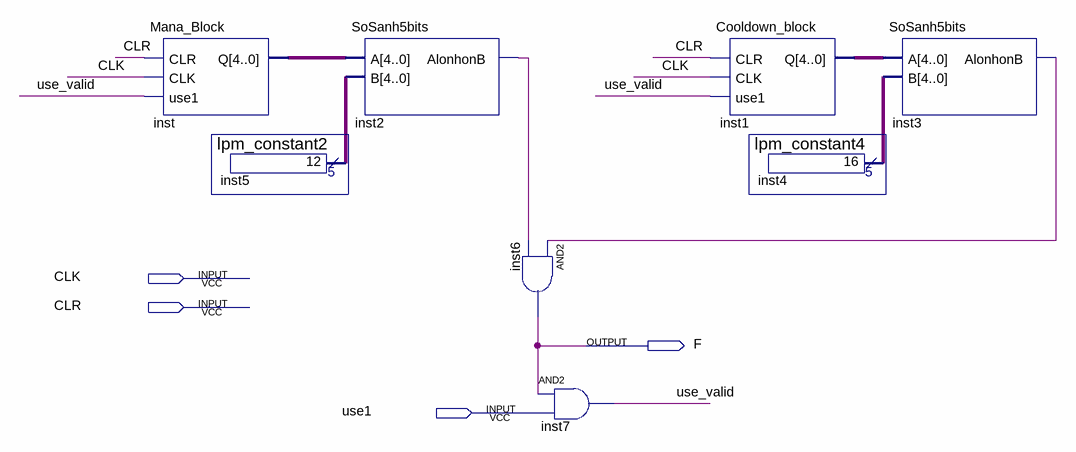
[diagram p0: schematic sheet]
// Quartus schematic ManaPlasmaField.bdf as structural Verilog: 8 symbols, 4 pins
module ManaPlasmaField (
  input  CLK,
  input  CLR,
  input  use1,
  output F
);

  wire inst2_alonhonb, inst3_alonhonb, use_valid;
  wire [4:0] inst1_q, inst4_result, inst5_result, inst_q;

  Mana_Block inst (.CLR(CLR), .CLK(CLK), .use1(use_valid), .Q(inst_q));
  lpm_constant2 inst5 (.result(inst5_result));
  SoSanh5bits inst2 (.A(inst_q), .B(inst5_result), .AlonhonB(inst2_alonhonb));
  and inst6 (F, inst3_alonhonb, inst2_alonhonb);
  and inst7 (use_valid, F, use1);
  Cooldown_block inst1 (.CLR(CLR), .CLK(CLK), .use1(use_valid), .Q(inst1_q));
  lpm_constant4 inst4 (.result(inst4_result));
  SoSanh5bits inst3 (.A(inst1_q), .B(inst4_result), .AlonhonB(inst3_alonhonb));
endmodule
